# EasyEDA Pro project ProProject_keyboard_Tassel43_2024-03-30.epro, board 主控
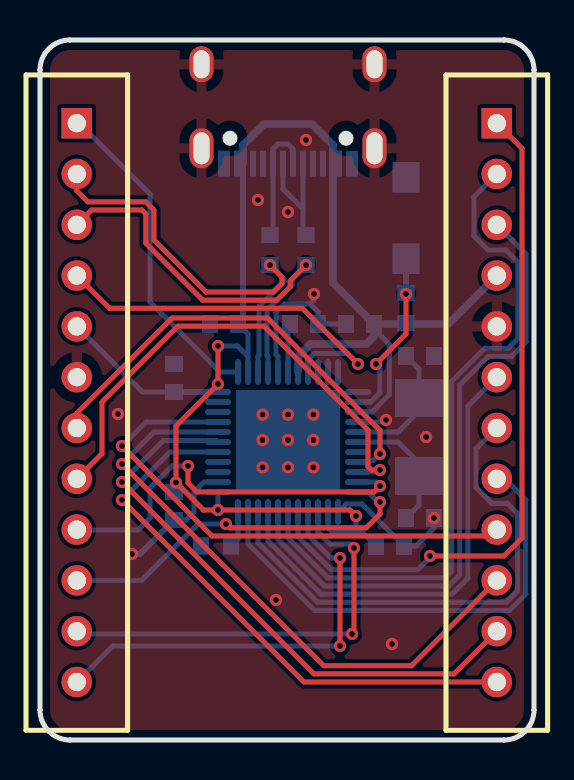
[diagram p15: board, top side]
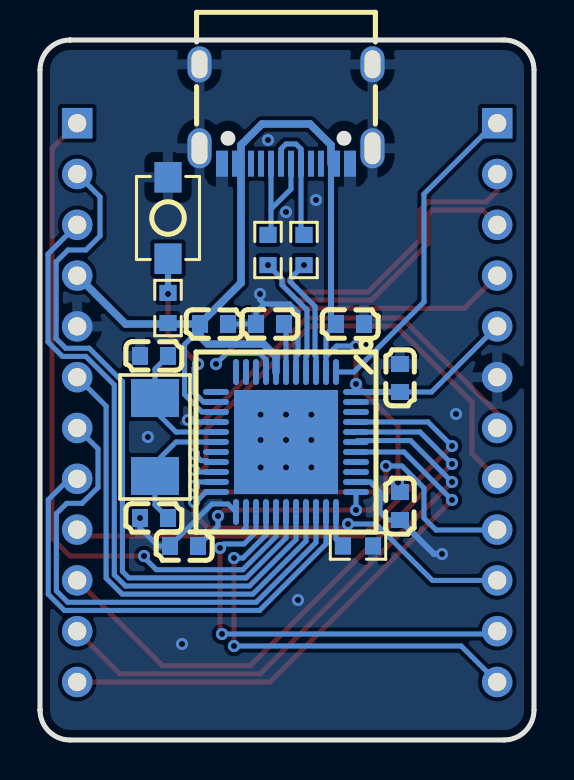
[diagram p16: board, bottom side, seen from below]

Outline 24.7 x 35 mm; copper layers: Top Layer, Bottom Layer. Coordinates in mm from the lower left corner of the outline.
Outline path: 0,33.5 arc(0.44,34.56) 1.5,35 23.2,35 arc(24.26,34.56) 24.7,33.5 24.7,1.5 arc(24.26,0.44) 23.2,0 1.5,0 arc(0.44,0.44) 0,1.5 0,33.5
Stack: Top Layer 0.035mm / Dielectric1 1.51mm FR4 er 4.5 / Bottom Layer 0.035mm

## Design rules (mm)
net D-: DP3
net D+: DP3
net U1_17: DP2
net U1_16: DP2
net USBC1_B6: DP1
net USBC1_B7: DP1
spacing Default (default): track to track 0.152, other pairs 0 to 0.152
track width Default (default): min 0.254, default 0.254, max 25.4
differential pair differentialPair (default): width min 0.127, default 0.254, max 2.54; gap min 0.152, default 0.152
via Default (default): diameter min 0.61, default 0.61, max 100.025; hole min 0.305, default 0.305, max 59.995
net GND uses gge38876(1)

## Placement (name value [footprint] x y rotation side)
1UF  1uF  [C0603]  13.2 20.8 180 bottom
22R  -  [R0603]  11.5 24.5 270 bottom
22R#2  -  [R0603]  13.3 24.5 90 bottom
C1  22pF  [C0603]  19 19.2 180 bottom
C2  22pF  [c0603]  19 11.1 180 bottom
C4  100nF  [C0603]  6.7 11.7 90 bottom
C5  100nF  [C0603]  9.2 20.8 0 bottom
C6  100nF  [C0603]  16 20.8 0 bottom
C7  100nF  [C0603]  6.7 18.1 270 bottom
C8  470nF  [C0603]  17.5 9.7 0 bottom
KEY1  Switch3x4x2  [SW-SMD_L4.0-W2.9-LS5.0]  18.3 26.1 90 bottom
R1  10K  [R0603]  18.3 21.6 90 bottom
R2  10K  [R0603]  8.8 9.7 180 bottom
U1  ATMEGA32U4-MU  [VQFN-44_L7.0-W7.0-P0.50-BL-EP5.2]  12.4 14.9 0 bottom
U3  -  [1X12排针]  20.3 28.3 0 top
U4  -  [1X12排针]  -0.7 28.3 0 top
USBC1  TYPE-C-31-M-12  [USB-C_SMD-TYPE-C-31-M-12]  12.4 31.3 0 bottom
X1  16MHZ  [osc-smd_2p-l5.0-w3.2]  18.95 15.15 270 bottom

## Footprints (pads in the part's own frame, mm; a bottom-side part is the same pattern mirrored in y, then rotated)
1X12排针
  rect 1.524x1.524 hole 0.914: 1(2.54,2.54)
  round 1.524 hole 0.914: 2(2.541,0) 3(2.541,-2.54) 4(2.541,-5.08) 5(2.541,-7.62) 6(2.541,-10.16) 7(2.541,-12.7) 8(2.541,-15.24) 9(2.541,-17.78) 10(2.541,-20.32) 11(2.541,-22.86) 12(2.541,-25.4)
C0603
  rect 0.8x0.9 smd: 1(-0.7,0) 2(0.7,0)
c0603
  rect 0.8x0.9 smd: 1(-0.7,0) 2(0.7,0)
osc-smd_2p-l5.0-w3.2
  rect 1.9x2.4 smd: 1(-1.95,0) 2(1.95,0)
R0603
  rect 0.806x0.864 smd: 1(-0.753,0) 2(0.753,0)
SW-SMD_L4.0-W2.9-LS5.0
  rect 1.53x1.36 smd: 1(-2.035,0) 2(2.035,0)
USB-C_SMD-TYPE-C-31-M-12
  oval 1.2x1.8 hole 0.8x1.4: 0(4.325,-2.484) 3(-4.325,-2.484)
  oval 1.2x2 hole 0.8x1.6: 1(4.325,1.716) 2(-4.325,1.716)
  rect 0.3x1.3 smd: A1(-3.35,2.484) A4(-2.55,2.484) A5(-1.25,2.485) A6(-0.25,2.485) A7(0.25,2.485) A8(1.25,2.485) A9(2.55,2.484) A12(3.35,2.485) B1(3.05,2.485) B4(2.25,2.484) B5(1.75,2.485) B6(0.75,2.485) B7(-0.75,2.485) B8(-1.75,2.485) B9(-2.25,2.484) B12(-3.05,2.485)
VQFN-44_L7.0-W7.0-P0.50-BL-EP5.2
  oval 0.3x1.3 smd: 1(-2.5,-3.5) 2(-2,-3.5) 3(-1.5,-3.5) 4(-1,-3.5) 5(-0.5,-3.5) 6(0,-3.5) 7(0.5,-3.5) 8(1,-3.5) 9(1.5,-3.5) 10(2,-3.5) 11(2.5,-3.5) 23(2.5,3.5) 24(2,3.5) 25(1.5,3.5) 26(1,3.5) 27(0.5,3.5) 28(0,3.5) 29(-0.5,3.5) 30(-1,3.5) 31(-1.5,3.5) 32(-2,3.5) 33(-2.5,3.5)
  oval 1.3x0.3 smd: 12(3.5,-2.5) 13(3.5,-2) 14(3.5,-1.5) 15(3.5,-1) 16(3.5,-0.5) 17(3.5,0) 18(3.5,0.5) 19(3.5,1) 20(3.5,1.5) 21(3.5,2) 22(3.5,2.5) 34(-3.5,2.5) 35(-3.5,2) 36(-3.5,1.5) 37(-3.5,1) 38(-3.5,0.5) 39(-3.5,0) 40(-3.5,-0.5) 41(-3.5,-1) 42(-3.5,-1.5) 43(-3.5,-2) 44(-3.5,-2.5)
  rect 5.2x5.2 smd: 45(0,0)

## Nets
GND: 1UF.1 C1.1 C2.1 C4.1 C5.1 C6.1 C7.1 C8.2 KEY1.2 R2.2 U1.5 U1.15 U1.23 U1.35 U1.43 U3.5 U4.6 USBC1.0 USBC1.1 USBC1.2 USBC1.3 USBC1.A1 USBC1.A12 USBC1.B1 USBC1.B12
VCC: C4.2 C5.2 C6.2 C7.2 C8.1 R1.1 U1.2 U1.7 U1.14 U1.24 U1.34 U1.44 U3.4 U4.5 USBC1.A4 USBC1.A9 USBC1.B4 USBC1.B9
CAPLED: U1.1 U4.1
COL0: U1.32 U3.8
COL1: U1.31 U3.7
COL2: U1.30 U3.6
COL3: U1.29 U3.3
COL4: U1.28 U3.2
COL5: U1.27 U3.1
COL6: U1.26 U4.12
COL7: U1.25 U4.11
COL8: U1.22 U4.10
COL9: U1.21 U4.9
COL10: U1.20 U4.8
COL11: U1.19 U4.7
D+: 22R#2.1 U1.4 U4.3
D-: 22R.2 U1.3 U4.2
RESET: KEY1.1 R1.2 U1.13
RGB: U1.8 U4.4
ROW0: U1.41 U3.9
ROW1: U1.40 U3.10
ROW2: U1.39 U3.11
ROW3: U1.38 U3.12
U1_6: 1UF.2 U1.6
U1_16: C1.2 U1.16 X1.1
U1_17: C2.2 U1.17 X1.2
U1_33: R2.1 U1.33
USBC1_B6: 22R#2.2 USBC1.A6 USBC1.B6
USBC1_B7: 22R.1 USBC1.A7 USBC1.B7

Pads without a net: U1 9 10 11 12 18 36 37 42 45; USBC1 A5 A8 B5 B8

## Via types
v1: diameter 0.61, hole 0.305, Top Layer to Bottom Layer, 45 vias

## Routing (per net, layer and track width the routed paths; a pad name or vN(x,y) marks a point on that pad's centre or on a via; arc(x,y) is an arc through that point)
GND: length 22.7
  Bottom Layer w0.254: 13.5,21.8 12.22,21.8 11.8,21.38 11.8,19.28 11.9,19.18 U1.5 ; 13.5,21.8 13.7,22 v1(13.7,22.3) ; 13.5,21.8 13.9,21.4 1UF.1 ; v1(19.7,11.1) 19.7,10.6 18.8,9.7 C8.2 16.1,11.8 15.3,11.8 U1.23 ; U1.35 8.2,12.9 7.7,12.4 7.7,11.4 7.3,11 C4.1 ; 1UF.1 13.8,20.8 ; 1UF.1 C6.1 ; U1.15 17.2,15.9 v1(17.3,16)
  Bottom Layer w0.305: C4.1 5,9.3 v1(4.6,9.3)
  vias: v1(3.9,16.3) v1(10.9,27) v1(11.8,7) v1(12.4,26.4) v1(13.3,30) v1(17.6,4.8) v1(19.31,15.15)
VCC: length 78.9
  Top Layer w0.254: v1(8.9,19.7) v1(8.9,17.8) 6.8,15.7 v1(6.8,12.88) 8.18,11.5 v1(8.9,11.5) 15.5,11.5 v1(15.8,11.2)
  Bottom Layer w0.254: 16.1,10.4 C8.1 ; 16.1,10.4 15.8,10.7 v1(15.8,11.2) ; 16.1,10.4 14.62,10.4 14.4,10.62 U1.24 ; v1(8.9,17.8) U1.44 ; 10.4,19.17 10.4,20.3 C5.2 ; 10.4,19.17 U1.2 ; 10.4,19.17 9.87,19.7 v1(8.9,19.7) ; 16.7,20.55 17.47,19.78 17.47,17.27 16.6,16.4 U1.14 ; U4.5 5.12,17.4 C7.2 ; v1(6.8,12.88) 6.8,12.5 C4.2 ; v1(8.9,11.5) U1.34
  Bottom Layer w0.305: C5.2 10.15,21.05 USBC1.B9 ; U1.44 C7.2
  Bottom Layer w0.381: C6.2 14.65,22.85 USBC1.B4 14.65,29.75 13.6,30.8 11.2,30.8 10.15,29.75 USBC1.B9 ; C6.2 20.42,20.8 U3.4 ; C6.2 16.7,20.18 16.32,19.8 13.52,19.8 12.9,19.18 U1.7
(no net):
  vias: v1(11.13,16.27) v1(11.13,15) v1(11.13,13.63) v1(12.4,16.27) v1(12.4,15) v1(12.4,13.63) v1(13.67,16.27) v1(13.67,15) v1(13.67,13.63)
CAPLED: length 16.4
  Bottom Layer w0.254: U4.1 1.96,30.84 5.5,27.3 5.5,21.9 9,18.4 U1.1
COL0: length 23.8
  Bottom Layer w0.254: U1.32 10.4,9.8 13.72,6.48 23.48,6.48 24.29,7.29 24.29,12.01 23.24,13.06 U3.8
COL1: length 25.9
  Bottom Layer w0.254: U3.7 21.8,14.56 21.8,12.63 22.6,11.83 23.37,11.83 23.88,11.32 23.88,7.46 23.31,6.89 13.89,6.89 10.9,9.87 U1.31
COL2: length 23.5
  Bottom Layer w0.254: U3.6 21.39,16.69 21.39,8.09 20.59,7.29 14.06,7.29 11.4,9.95 U1.30
COL3: length 31.8
  Bottom Layer w0.254: U1.29 11.9,10.02 14.22,7.7 20.43,7.7 20.99,8.26 20.99,17.76 22.41,19.18 23.58,19.18 24.3,19.9 24.3,24.3 U3.3
COL4: length 34.3
  Bottom Layer w0.254: U3.2 21.7,27.16 21.7,25.2 22.4,24.5 23.3,24.5 23.89,23.91 23.89,20.07 23.41,19.59 22.24,19.59 20.58,17.93 20.58,8.43 20.26,8.11 14.39,8.11 12.4,10.1 U1.28
COL5: length 35.1
  Top Layer w0.254: U3.1 24.1,29.58 24.1,10.1 23.2,9.2 v1(19.5,9.2)
  Bottom Layer w0.254: U1.27 12.9,10.17 14.56,8.51 18.88,8.51 19.5,9.13 v1(19.5,9.2)
COL6: length 21.5
  Top Layer w0.254: v1(15,4.7) v1(15,9.1)
  Bottom Layer w0.254: v1(15,9.1) 14.55,9.1 13.4,10.25 U1.26 ; U4.12 3.64,4.7 v1(15,4.7)
COL7: length 21.3
  Top Layer w0.254: v1(15.7,9.6) 15.7,5.4 v1(15.6,5.3)
  Bottom Layer w0.254: U1.25 13.9,10.4 14.5,9.8 15.5,9.8 v1(15.7,9.6) ; v1(15.6,5.3) 1.98,5.3 U4.11
COL8: length 18.6
  Top Layer w0.254: v1(17,11.9) 17,11.3 16.31,10.61 9.49,10.61 v1(9.3,10.8)
  Bottom Layer w0.254: U1.22 16.4,12.4 16.9,11.9 v1(17,11.9) ; U4.10 5.08,7.98 7.9,10.8 v1(9.3,10.8)
COL9: length 19.7
  Top Layer w0.254: v1(17,12.7) 16.7,12.4 7.85,12.4 7.4,12.85 v1(7.4,13.7)
  Bottom Layer w0.254: U1.21 16.8,12.9 v1(17,12.7) ; v1(7.4,13.7) 6.6,13.7 5.5,12.6 5.5,11.1 4.9,10.5 1.86,10.5 U4.9
COL10: length 25
  Top Layer w0.254: v1(17,13.5) 16.57,13.5 16.4,13.67 16.4,15.5 11.81,20.09 11.8,20.09 11.2,20.69 6.9,20.69 3.1,16.89 3.1,14.32 U4.8
  Bottom Layer w0.254: v1(17,13.5) 16.9,13.4 U1.20
COL11: length 22.6
  Top Layer w0.254: U4.7 1.84,16.34 6.6,21.1 11.37,21.1 17,15.47 v1(17,14.3)
  Bottom Layer w0.254: v1(17,14.3) 16.98,14.3 16.65,13.97 16.37,13.97 16.3,13.9 U1.19
D+: length 21.6
  Top Layer w0.254: U4.3 2.58,26.5 5.1,26.5 5.29,26.31 5.29,24.83 8.13,21.99 11.84,21.99 12.51,22.66 12.51,22.95 v1(13.3,23.75)
  Bottom Layer w0.254: U1.4 11.4,19.18 11.35,19.22 11.35,21.5 12.6,22.75 12.6,23.05 v1(13.3,23.75)
D-: length 21.6
  Top Layer w0.254: v1(11.5,23.75) 12.1,23.15 12.1,22.83 11.67,22.4 8.3,22.4 5.7,25 5.7,26.5 5.29,26.91 2.39,26.91 1.84,27.46 U4.2
  Bottom Layer w0.254: v1(11.5,23.75) 12.2,23.05 12.2,22.92 10.95,21.67 10.95,19.22 10.9,19.18 U1.3
RESET: length 8.6
  Top Layer w0.254: v1(18.3,22.3) 18.3,20.3 v1(16.8,18.8)
  Bottom Layer w0.254: v1(16.8,18.8) 16.99,18.61 16.99,17.37 16.53,16.9 U1.13
  Bottom Layer w0.305: R1.2 18.3,24.06
RGB: length 19.4
  Top Layer w0.254: v1(15.9,18.8) 13.11,21.59 3.47,21.59 U4.4
  Bottom Layer w0.254: v1(15.9,18.8) 15.37,19.33 13.72,19.33 13.4,19.01 U1.8
ROW0: length 26
  Top Layer w0.254: U3.9 22.52,10.2 8.6,10.2 v1(4.1,14.7)
  Bottom Layer w0.254: v1(4.1,14.7) 5.3,15.9 U1.41
ROW1: length 30.1
  Top Layer w0.254: v1(4.1,13.8) 14.19,3.71 18.57,3.71 U3.10
  Bottom Layer w0.254: U1.40 5.7,15.4 v1(4.1,13.8)
ROW2: length 29.3
  Top Layer w0.254: U3.11 20.71,3.31 13.69,3.31 v1(4.1,12.9)
  Bottom Layer w0.254: U1.39 8.83,14.97 6.17,14.97 v1(4.1,12.9)
ROW3: length 28.3
  Top Layer w0.254: U3.12 13.2,2.9 v1(4.1,12)
  Bottom Layer w0.254: U1.38 6.5,14.4 v1(4.1,12)
U1_6: length 2.4
  Bottom Layer w0.254: 1UF.2 12.4,20.7 U1.6
U1_16: length 6.5
  Bottom Layer w0.254: U1.16 17.9,15.4 18.95,16.45 X1.1 18.95,18.55 C1.2
U1_17: length 6.5
  Bottom Layer w0.254: C2.2 18.95,11.75 X1.2 18.95,13.85 17.9,14.9 U1.17
U1_33: length 1.8
  Bottom Layer w0.254: R2.1 9.9,10.05 U1.33
USBC1_B6: length 6.3
  Bottom Layer w0.254: 13.15,26.55 12.15,27.55 USBC1.A6 ; 13.15,26.55 13.15,25.4 22R#2.2 ; 13.15,26.55 USBC1.B6
USBC1_B7: length 6.3
  Bottom Layer w0.254: USBC1.A7 12.65,29.55 12.4,29.8 11.9,29.8 11.65,29.55 USBC1.B7 11.65,25.4 22R.1

## Copper pours and planes (outline as drawn; the poured copper is in the pictures)
GND on Top Layer: 0,35.1 24.9,35.1 24.9,-0.1 0,-0.1
GND on Bottom Layer: -0.1,35.1 24.8,35.1 24.8,-0.1 -0.1,-0.1
